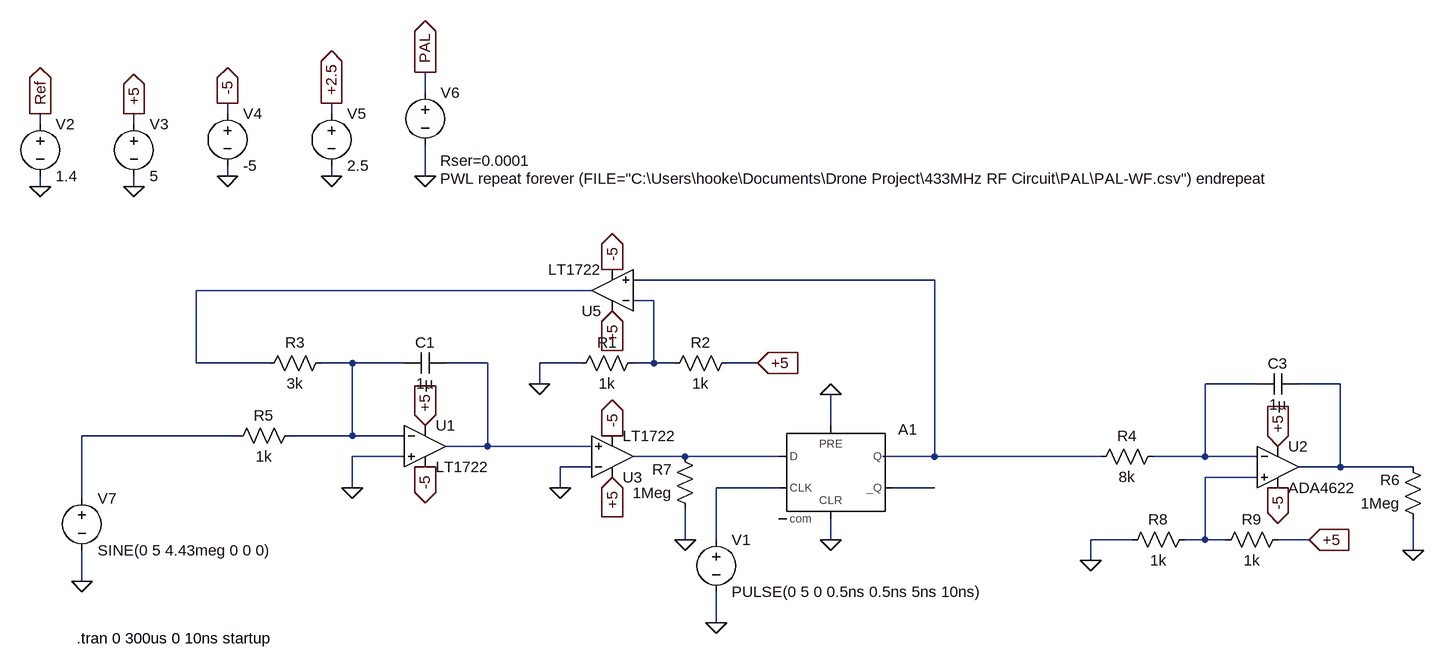
[diagram p0: schematic ADC.asc]
ADC.asc, the LTspice schematic file:
Version 4
SHEET 1 1524 680
WIRE -384 -400 -384 -432
WIRE -688 -368 -688 -384
WIRE -528 -368 -528 -384
WIRE -976 -352 -976 -368
WIRE -832 -352 -832 -368
WIRE -688 -272 -688 -288
WIRE -528 -272 -528 -288
WIRE -384 -272 -384 -320
WIRE -976 -256 -976 -272
WIRE -832 -256 -832 -272
WIRE 400 -112 -64 -112
WIRE -128 -96 -736 -96
WIRE -32 -80 -64 -80
WIRE -736 16 -736 -96
WIRE -624 16 -736 16
WIRE -496 16 -544 16
WIRE -416 16 -496 16
WIRE -288 16 -352 16
WIRE -144 16 -208 16
WIRE -32 16 -32 -80
WIRE -32 16 -64 16
WIRE 0 16 -32 16
WIRE 128 16 80 16
WIRE -208 48 -208 16
WIRE 896 48 816 48
WIRE 1024 48 960 48
WIRE 240 112 240 64
WIRE -672 128 -912 128
WIRE -496 128 -496 16
WIRE -496 128 -592 128
WIRE -416 128 -496 128
WIRE -288 144 -288 16
WIRE -288 144 -352 144
WIRE -128 144 -288 144
WIRE -416 160 -496 160
WIRE 16 160 -64 160
WIRE 160 160 16 160
WIRE 400 160 400 -112
WIRE 400 160 320 160
WIRE 656 160 400 160
WIRE 816 160 816 48
WIRE 816 160 736 160
WIRE 896 160 816 160
WIRE -128 176 -176 176
WIRE 1024 176 1024 48
WIRE 1024 176 960 176
WIRE 1136 176 1024 176
WIRE 896 192 816 192
WIRE -496 208 -496 160
WIRE -176 208 -176 176
WIRE 160 208 64 208
WIRE 400 208 336 208
WIRE -912 224 -912 128
WIRE 16 288 16 240
WIRE 64 288 64 208
WIRE 240 288 240 256
WIRE 704 288 640 288
WIRE 816 288 816 192
WIRE 816 288 784 288
WIRE 848 288 816 288
WIRE 976 288 928 288
WIRE 1136 304 1136 256
WIRE 640 320 640 288
WIRE -912 352 -912 304
WIRE 64 416 64 368
FLAG -384 112 +5
IOPIN -384 112 In
FLAG -384 176 -5
IOPIN -384 176 Out
FLAG 128 16 +5
IOPIN 128 16 In
FLAG -208 48 0
FLAG -176 208 0
FLAG 64 416 0
FLAG -832 -256 0
FLAG -688 -272 0
FLAG -832 -368 +5
IOPIN -832 -368 Out
FLAG -688 -384 -5
IOPIN -688 -384 Out
FLAG -96 -128 -5
IOPIN -96 -128 Out
FLAG -96 -64 +5
IOPIN -96 -64 In
FLAG -96 192 +5
IOPIN -96 192 In
FLAG -96 128 -5
IOPIN -96 128 Out
FLAG -528 -272 0
FLAG -528 -384 +2.5
IOPIN -528 -384 Out
FLAG 928 144 +5
IOPIN 928 144 In
FLAG 928 208 -5
IOPIN 928 208 Out
FLAG 240 64 0
FLAG 240 288 0
FLAG 1136 304 0
FLAG 16 288 0
FLAG 976 288 +5
IOPIN 976 288 In
FLAG 640 320 0
FLAG -384 -432 PAL
IOPIN -384 -432 Out
FLAG -384 -272 0
FLAG -976 -256 0
FLAG -976 -368 Ref
IOPIN -976 -368 Out
FLAG -912 352 0
FLAG -496 208 0
SYMBOL res -48 0 R90
WINDOW 0 0 56 VBottom 2
WINDOW 3 32 56 VTop 2
SYMATTR InstName R1
SYMATTR Value 1k
SYMBOL res 96 0 R90
WINDOW 0 0 56 VBottom 2
WINDOW 3 32 56 VTop 2
SYMATTR InstName R2
SYMATTR Value 1k
SYMBOL cap -352 0 R90
WINDOW 0 0 32 VBottom 2
WINDOW 3 32 32 VTop 2
SYMATTR InstName C1
SYMATTR Value 1µ
SYMBOL res -528 0 R90
WINDOW 0 0 56 VBottom 2
WINDOW 3 32 56 VTop 2
SYMATTR InstName R3
SYMATTR Value 3k
SYMBOL Digital\\dflop 240 112 R0
WINDOW 3 0 0 Invisible 0
SYMATTR InstName A1
SYMATTR SpiceLine Trise=0.5n Tfall=0.5n td=1n
SYMATTR Value Vhigh=5V Vlow=0V
SYMBOL voltage 64 272 R0
WINDOW 123 0 0 Left 0
WINDOW 39 0 0 Left 0
SYMATTR InstName V1
SYMATTR Value PULSE(0 5 0 0.5ns 0.5ns 5ns 10ns)
SYMBOL voltage -832 -368 R0
WINDOW 123 0 0 Left 0
WINDOW 39 0 0 Left 0
SYMATTR InstName V3
SYMATTR Value 5
SYMBOL voltage -688 -384 R0
WINDOW 123 0 0 Left 0
WINDOW 39 0 0 Left 0
SYMATTR InstName V4
SYMATTR Value -5
SYMBOL voltage -528 -384 R0
WINDOW 123 0 0 Left 0
WINDOW 39 0 0 Left 0
SYMATTR InstName V5
SYMATTR Value 2.5
SYMBOL cap 960 32 R90
WINDOW 0 0 32 VBottom 2
WINDOW 3 32 32 VTop 2
SYMATTR InstName C3
SYMATTR Value 1µ
SYMBOL res 752 144 R90
WINDOW 0 0 56 VBottom 2
WINDOW 3 32 56 VTop 2
SYMATTR InstName R4
SYMATTR Value 8k
SYMBOL res 1152 272 R180
WINDOW 0 36 76 Left 2
WINDOW 3 36 40 Left 2
SYMATTR InstName R6
SYMATTR Value 1Meg
SYMBOL res 32 256 R180
WINDOW 0 36 76 Left 2
WINDOW 3 36 40 Left 2
SYMATTR InstName R7
SYMATTR Value 1Meg
SYMBOL res 800 272 R90
WINDOW 0 0 56 VBottom 2
WINDOW 3 32 56 VTop 2
SYMATTR InstName R8
SYMATTR Value 1k
SYMBOL res 944 272 R90
WINDOW 0 0 56 VBottom 2
WINDOW 3 32 56 VTop 2
SYMATTR InstName R9
SYMATTR Value 1k
SYMBOL Opamps\\ADA4622 928 112 R0
SYMATTR InstName U2
SYMBOL voltage -384 -416 R0
WINDOW 39 23 120 Left 2
WINDOW 3 23 148 Left 2
SYMATTR SpiceLine Rser=0.0001
SYMATTR Value PWL repeat forever (FILE="C:\Users\hooke\Documents\Drone Project\433MHz RF Circuit\PAL\PAL-WF.csv") endrepeat
SYMATTR InstName V6
SYMBOL res -576 112 R90
WINDOW 0 0 56 VBottom 2
WINDOW 3 32 56 VTop 2
SYMATTR InstName R5
SYMATTR Value 1k
SYMBOL voltage -976 -368 R0
WINDOW 123 0 0 Left 0
WINDOW 39 0 0 Left 0
SYMATTR InstName V2
SYMATTR Value 1.4
SYMBOL voltage -912 208 R0
WINDOW 123 0 0 Left 0
WINDOW 39 0 0 Left 0
SYMATTR InstName V7
SYMATTR Value SINE(0 5 4.43meg 0 0 0)
SYMBOL Opamps\\LT1722 -384 80 R0
SYMATTR InstName U1
SYMBOL Opamps\\LT1722 -96 224 M180
SYMATTR InstName U3
SYMBOL Opamps\\LT1722 -96 -32 R180
SYMATTR InstName U5
TEXT -920 440 Left 2 !.tran 0 300us 0 10ns startup

The netlist it stands for:
* ADC.asc
R1 N003 0 1k
R2 +5 N003 1k
C1 N005 N004 1µ
R3 N004 N002 3k
A1 N009 0 N011 0 0 N012 N001 0 DFLOP Vhigh=5V Vlow=0V Trise=0.5n Tfall=0.5n td=1n
V1 N011 0 PULSE(0 5 0 0.5ns 0.5ns 5ns 10ns)
V3 +5 0 5
V4 -5 0 -5
V5 +2.5 0 2.5
C3 N007 N006 1µ
R4 N006 N001 8k
R6 0 N007 1Meg
R7 0 N009 1Meg
R8 N010 0 1k
R9 +5 N010 1k
XU2 N010 N006 +5 -5 N007 ADA4622  ; pins In+ In- V+ V- OUT
V6 PAL 0 PWL repeat forever (FILE="C:\Users\hooke\Documents\Drone Project\433MHz RF Circuit\PAL\PAL-WF.csv") endrepeat Rser=0.0001
R5 N004 N008 1k
V2 Ref 0 1.4
V7 N008 0 SINE(0 5 4.43meg 0 0 0)
XU1 0 N004 +5 -5 N005 LT1722  ; pins In+ In- V+ V- OUT
XU3 N005 0 +5 -5 N009 LT1722  ; pins In+ In- V+ V- OUT
XU5 N001 N003 +5 -5 N002 LT1722  ; pins In+ In- V+ V- OUT
.tran 0 300us 0 10ns startup
.lib ADA4622.lib
.backanno
.end